# EasyEDA Pro project 交换机工具.epro, schematic Schematic2
Board Name: Board2; Create Date: 2026-06-15; Page Name: P1; Project Name: switch_tool2; Schematic Name: Schematic2; Update Date: 2026-06-18; Company: 嘉立创EDA; Page Size: A4; Version: V1.0
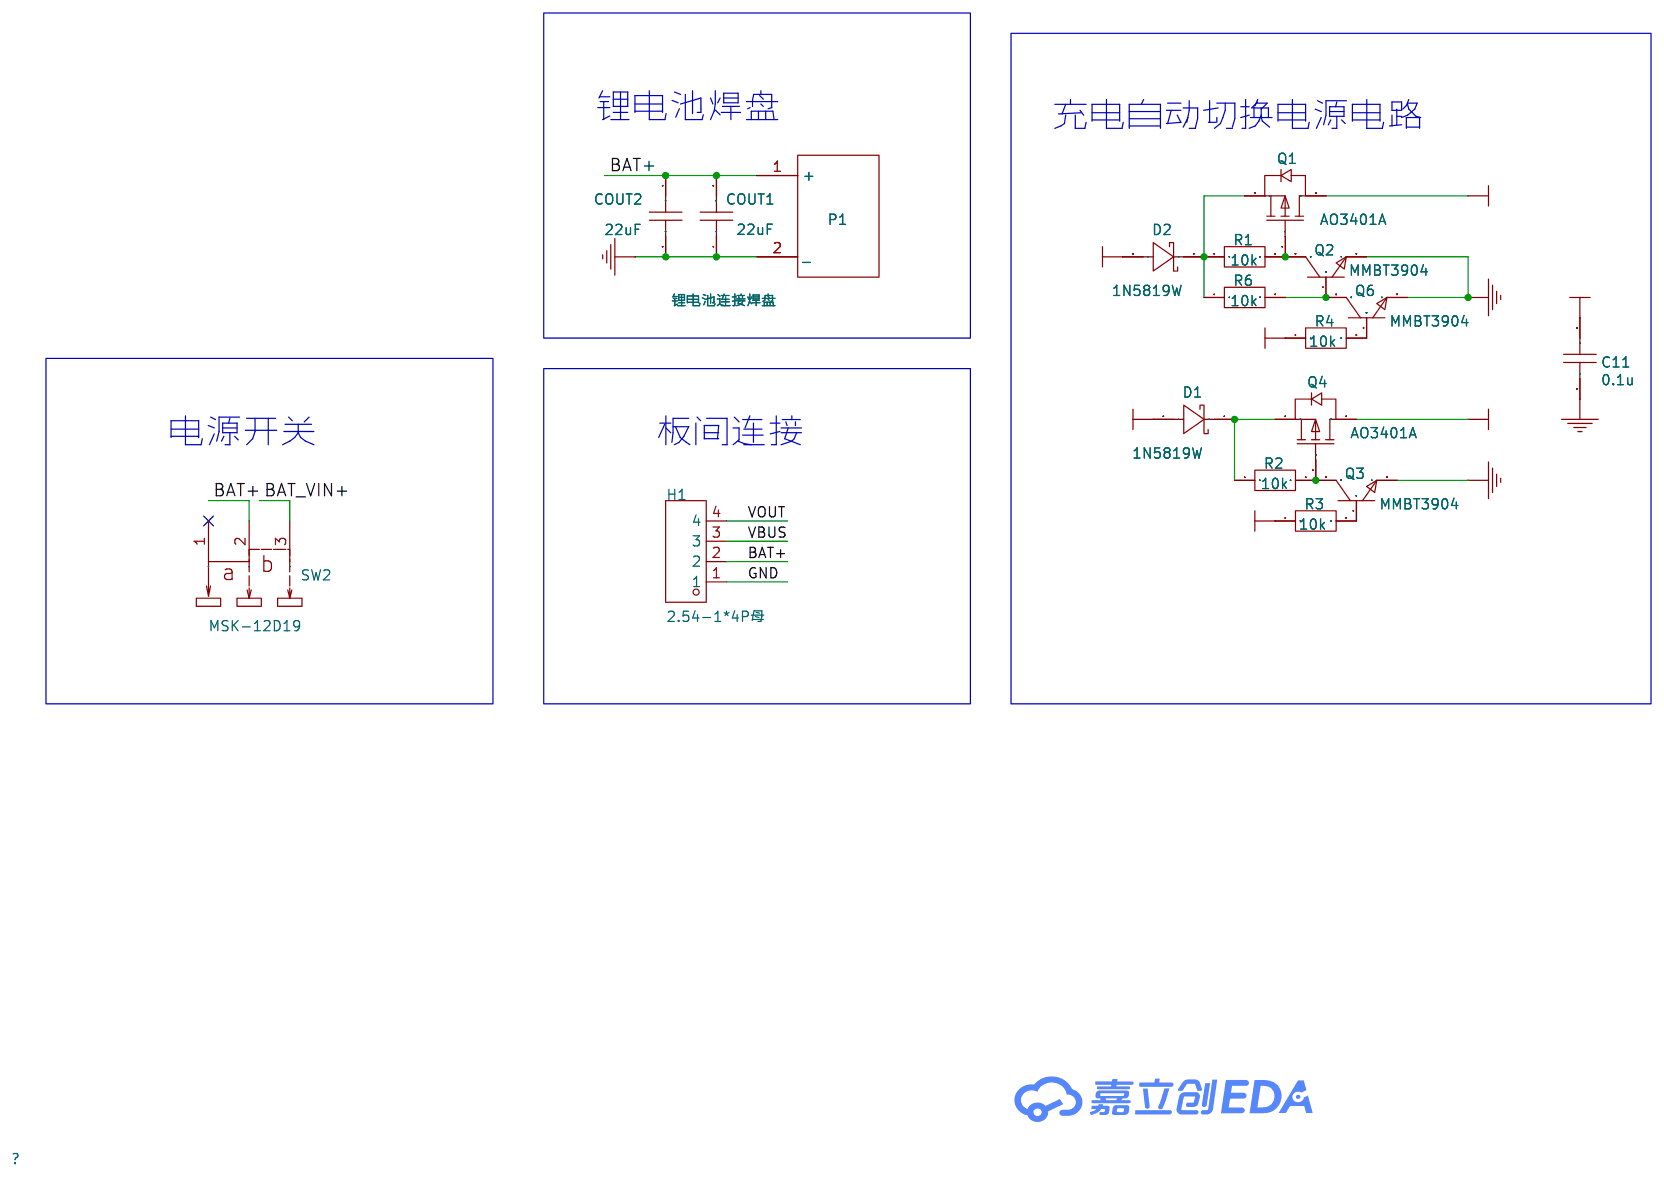
[diagram p0: schematic sheet]

## Parts
C11  0.1u  [C0805]
COUT1  22uF  [C0805]
COUT2  22uF  [C0805]
D1  1N5819W  [D0805]
D2  1N5819W  [D0805]
H1  2.54-1*4P母  [HDR-TH_4P-P2.54-V-F]
P1  锂电池连接焊盘  [3.7V电池]
Q1  AO3401A  [SOT-23-3_L2.9-W1.5-P1.90-LS2.6-BL]
Q2  MMBT3904  [SOT-23-3_L2.9-W1.5-P1.90-LS2.6-BL]
Q3  MMBT3904  [SOT-23-3_L2.9-W1.5-P1.90-LS2.6-BL]
Q4  AO3401A  [SOT-23-3_L2.9-W1.5-P1.90-LS2.6-BL]
Q6  MMBT3904  [SOT-23-3_L2.9-W1.5-P1.90-LS2.6-BL]
R1  10k  [R0805]
R2  10k  [R0805]
R3  10k  [R0805]
R4  10k  [R0805]
R6  10k  [R0805]
SW2  MSK-12D19  [SW-TH_MSK-12D19H]

## Library data of the parts
C11 = 0.1u: nameAlias: Value(F); Contributor: LCEDA_Lib; spicePre: C; spiceSymbolName: C_0603_US
COUT1 COUT2 = EMK316ABJ226KL-T: Supplier: LCSC; Supplier Part: C319197; Manufacturer: Taiyo Yuden; nameAlias: Capacitance; Contributor: LCSC; spicePre: C
D1 D2 = 1N5819W: Supplier: LCSC; Supplier Part: C2905650; Manufacturer: TECH PUBLIC(台舟); JLCPCB Part Class: Extended Part; Contributor: lcsc; spicePre: D; spiceSymbolName: 1N5819W_C2905650
H1 = 2.54-1*4P母: 插孔结构:1x4P;间距:2.54mm;行距:-;圆孔/方孔:方孔;安装方式:直插;排数:单排;总孔位数:4P;额定电流:3A;额定电压:-;插孔方向:顶部;塑高:-;触头材质:青铜;触头镀层:-;工作温度:-40℃~+105℃;; LCSC Part Name: 间距:2.54mm 1x4P 直插; Supplier Part: C2718488; Manufacturer: BOOMELE(博穆精密); Supplier Footprint: 插件,P=2.54mm; JLCPCB Part Class: 扩展库; Datasheet: https://item.szlcsc.com/datasheet/2.54-1*4P%25E6%25AF%258D/2834502.html; Supplier: LCSC; Holes Structure: 1x4P; Pitch: 2.54mm; Circular Hole / Square Hole: 方孔; Mounting Type: 直插; Number of Rows: 单排; Number of Positions: 4P; Current Rating: 3A; Holes Direction: 顶部; Contact Material: 青铜; Operating Temperature: -40℃~+105℃
P1 = 锂电池连接焊盘: Contributor: naive; spicePre: P; spiceSymbolName: battery_ph2.0直插
Q1 Q4 = AO3401A: Supplier: LCSC; Manufacturer: AOS; Supplier Part: C15127; JLCPCB Part Class: Basic Part; spicePre: Q
Q2 Q3 Q6 = MMBT3904: Supplier: LCSC; Manufacturer: CJ; Supplier Part: C20526; JLCPCB Part Class: Basic Part; Contributor: 立创EDA官方封装库; spicePre: Q; spiceSymbolName: MMBT3904-C20526
R1-R4 R6 = 10k: nameAlias: Value(Ω); Contributor: LCEDA_Lib; spicePre: R; spiceSymbolName: R_0603_EU
SW2 = MSK-12D19: Supplier Part: C223843; Manufacturer: Korean Hroparts Elec; link: https://item.taobao.com/item.htm?spm=a1z09.2.0.0.7edf2e8dkHTu5U&id=558001607668&_u=d268gp8mbc51; Contributor: Kunger; spicePre: S

## Nets
GND: C11.1 COUT1.1 COUT2.2 H1.1 P1.2(_) Q2.2(E) Q3.2(E) Q6.2(E)
VBUS: D1.2(A) H1.3 R3.1 R4.1
BAT+: COUT1.2 COUT2.1 H1.2 P1.1(+) SW2.2
BAT_VIN+: D2.2(A) SW2.3
VOUT: C11.2 H1.4 Q1.3(D) Q4.3(D)
$1N864: Q2.1(B) Q6.3(C) R6.2
$1N866: Q1.1(G) Q2.3(C) R1.2
$1N867: D1.1(K) Q4.2(S) R2.1
$1N868: D2.1(K) Q1.2(S) R1.1 R6.1
$1N875: Q6.1(B) R4.2
$1N878: Q3.3(C) Q4.1(G) R2.2
$1N879: Q3.1(B) R3.2

Not connected (* = marked no-connect by the designer): SW2 1*

## Notes on the sheet
- 锂电池焊盘
- 充电自动切换电源电路
- 电源开关
- 板间连接
